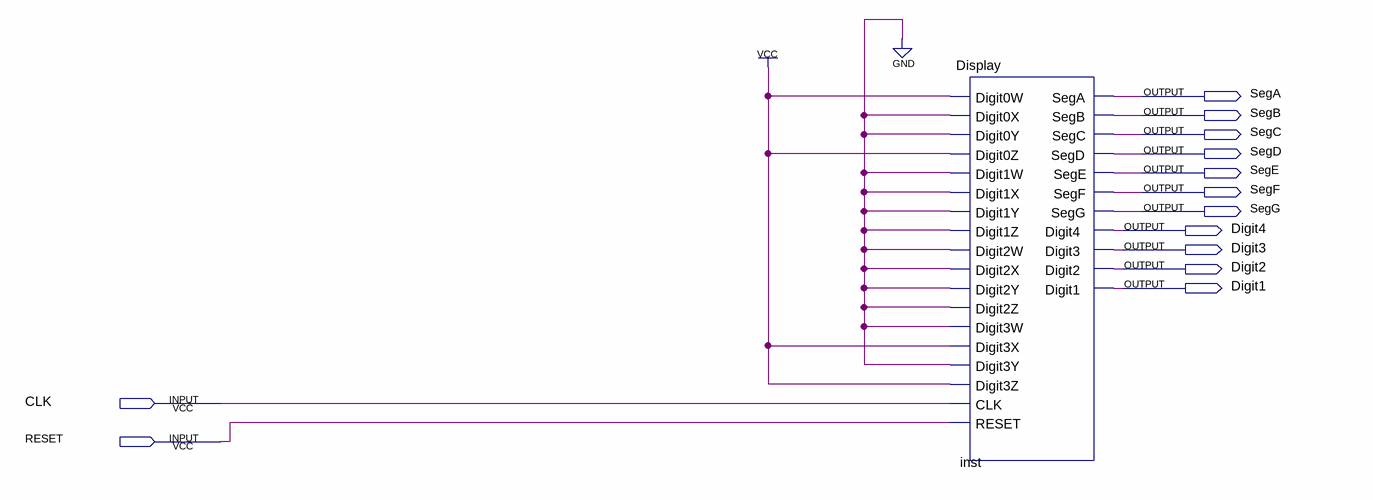
[diagram p0: schematic sheet]
// Quartus schematic distanceMeasure.bdf as structural Verilog: 1 symbols, 13 pins
module distanceMeasure (
  input  CLK,
  input  RESET,
  output SegA,
  output SegB,
  output SegC,
  output SegD,
  output SegE,
  output SegF,
  output SegG,
  output Digit4,
  output Digit3,
  output Digit2,
  output Digit1
);

  Display inst (
    .Digit0W(1'b1), .Digit0X(1'b0), .Digit0Y(1'b0), .Digit0Z(1'b1), .Digit1W(1'b0), .Digit1X(1'b0),
    .Digit1Y(1'b0), .Digit1Z(1'b0), .Digit2W(1'b0), .Digit2X(1'b0), .Digit2Y(1'b0), .Digit2Z(1'b0),
    .Digit3W(1'b0), .Digit3X(1'b1), .Digit3Y(1'b0), .Digit3Z(1'b1), .CLK(CLK), .RESET(RESET), .SegA(SegA),
    .SegB(SegB), .SegC(SegC), .SegD(SegD), .SegE(SegE), .SegF(SegF), .SegG(SegG), .Digit4(Digit4),
    .Digit3(Digit3), .Digit2(Digit2), .Digit1(Digit1));
endmodule
